# EAGLE design VoltageLevelMeter3 (EAGLE 9.6.2)
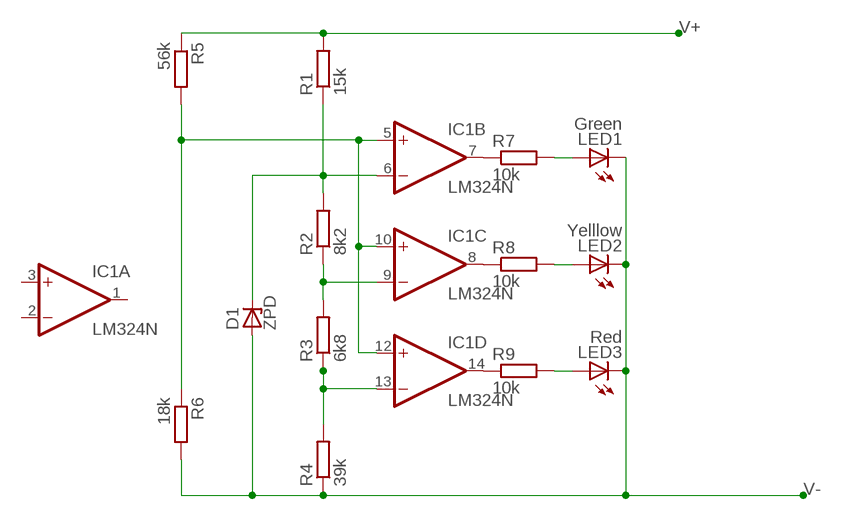
[diagram p0: schematic, sheet 1]

## Parts
D1  ZPD  [DO35Z10]
IC1  LM324N  [DIL14]
LED1  Green  LED3MM  [LED3MM]
LED2  Yelllow  LED3MM  [LED3MM]
LED3  Red  LED3MM  [LED3MM]
R1  15k  R-EU_0207/7  [0207/7]
R2  8k2  R-EU_0207/7  [0207/7]
R3  6k8  R-EU_0207/7  [0207/7]
R4  39k  R-EU_0207/7  [0207/7]
R5  56k  R-EU_0207/7  [0207/7]
R6  18k  R-EU_0207/7  [0207/7]
R7  10k  R-EU_0207/7  [0207/7]
R8  10k  R-EU_0207/7  [0207/7]
R9  10k  R-EU_0207/7  [0207/7]

## Nets
N$1: D1.C IC1.6(B:-IN) R1.1 R2.2
N$2: IC1.9(C:-IN) R2.1 R3.2
N$3: IC1.13(D:-IN) R3.1 R4.2
N$4: IC1.14(D:OUT) R9.1
N$5: IC1.8(C:OUT) R8.1
N$6: IC1.7(B:OUT) R7.1
N$7: IC1.5(B:+IN) IC1.10(C:+IN) IC1.12(D:+IN) R5.2 R6.1
N$10: LED1.A R7.2
N$11: LED2.A R8.2
N$12: LED3.A R9.2
V+: R1.2 R5.1
V-: D1.A LED1.K(C) LED2.K(C) LED3.K(C) R4.1 R6.2
Unconnected: IC1.1(A:OUT) IC1.2(A:-IN) IC1.3(A:+IN)

## Power pins joined to a net without a drawn wire
V+: IC1.4(P:V+)
V-: IC1.11(P:V-)

## Library data of the parts
D1 = diode:ZPD: Z DIODE 500 mW
IC1 = linear:LM324: OP AMP
LED1-LED3 = led:LED: LED OSRAM: - CHIPLED LG R971, LG N971, LY N971, LG Q971, LY Q971, LO R971, LY R971 LH N974, LH R974 LS Q976, LO Q976, LY Q976 LO Q996 - Hyper CHIPLED LW Q18S LB Q993, LB Q99A, LB R99A - SideLED LS A670, LO A670, LY A670, LG A670, LP A670 LB A673, LV A673, LT A673, LW A673 LH A674 LY A675 LS A676, LA A676, LO A676, LY A676, LW A676 LS A679, LY A679, LG A679 - Hyper Micro SIDELED® LS Y876, LA Y876, LO Y876, LY Y876 LT Y87S - SmartLED LW L88C, LW L88S LB L89C, LB L89S, LG L890 LS L89K, LO L89K, LY L89K LS L896, LA L896, LO L896, LY L896 - TOPLED LS T670, LO T670, LY T670, LG T670, LP T670 LSG T670, LSP T670, LSY T670, LOP T670, LYG T670 LG T671, LOG T671, LSG T671 LB T673, LV T673, LT T673, LW T673 LH T674 LS T676, LA T676, LO T676, LY T676, LB T676, LH T676, LSB T676, LW T676 LB T67C, LV T67C, LT T67C, LS T67K, LO T67K, LY T67K, LW E67C LS E67B, LA E67B, LO E67B, LY E67B, LB E67C, LV E67C, LT E67C LW T67C LS T679, LY T679, LG T679 LS T770, LO T770, LY T770, LG T770, LP T770 LB T773, LV T773, LT T773, LW T773 LH T774 LS E675, LA E675, LY E675, LS T675 LS T776, LA T776, LO T776, LY T776, LB T776 LHGB T686 LT T68C, LB T68C - Hyper Mini TOPLED® LB M676 - Mini TOPLED Santana® LG M470 LS M47K, LO M47K, LY M47K Source: http://www.osram.convergy.de LUXEON: - LUMILED® LXK2-PW12-R00, LXK2-PW12-S00, LXK2-PW14-U00, LXK2-PW14-V00 LXK2-PM12-R00, LXK2-PM12-S00, LXK2-PM14-U00 LXK2-PE12-Q00, LXK2-PE12-R00, LXK2-PE12-S00, LXK2-PE14-T00, LXK2-PE14-U00 LXK2-PB12-K00, LXK2-PB12-L00, LXK2-PB12-M00, LXK2-PB14-N00, LXK2-PB14-P00, LXK2-PB14-Q00 LXK2-PR12-L00, LXK2-PR12-M00, LXK2-PR14-Q00, LXK2-PR14-R00 LXK2-PD12-Q00, LXK2-PD12-R00, LXK2-PD12-S00 LXK2-PH12-R00, LXK2-PH12-S00 LXK2-PL12-P00, LXK2-PL12-Q00, LXK2-PL12-R00 Source: www.luxeon.com KINGBRIGHT: KA-3528ASYC Source: www.kingbright.com
R1-R9 = resistor:R-EU_: RESISTOR, European symbol

## Net classes
0 default: clearance 0.355 mm

## Board
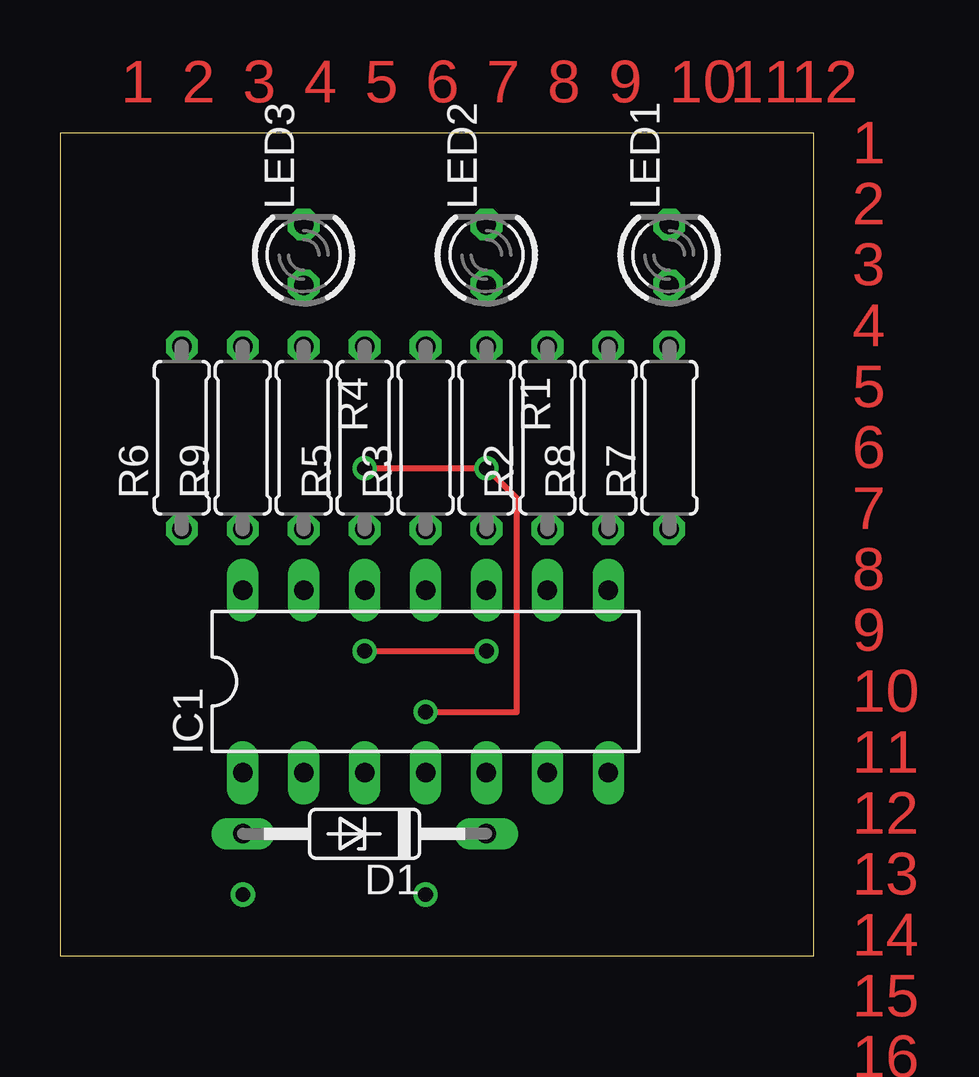
[diagram p1: board, top side]
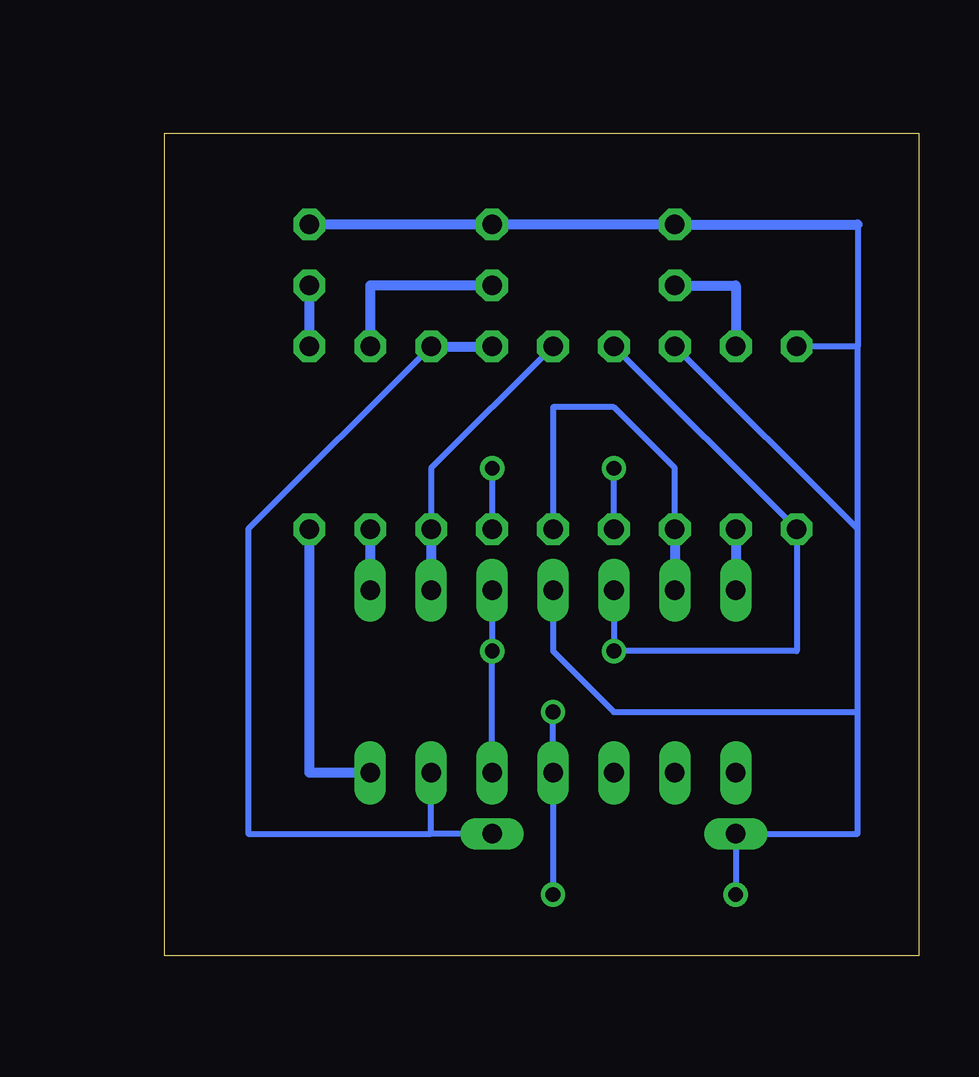
[diagram p2: board, bottom side, seen from below]

Size 31.42 x 34.28 mm. Coordinates in mm from the lower left corner, seen from the top.
Outline: 0,0 31.42,0 31.42,34.28 0,34.28 0,0
Copper layers (1*16): Top 0.035mm / dielectric 1.5mm / Bottom 0.035mm
Design rules "default": minimum track width 10mil, minimum drill 24mil, track to track 8mil, track to pad 8mil, pad to pad 8mil, via to via 8mil, smd to smd 8mil, copper to edge 40mil, drill to drill 8mil, minimum pad ring 10mil, minimum via ring 8mil, stop-mask expansion 4mil, vias tented up to drill 0mil, thermal gap 10mil

### Footprints (pad centres in the part's own frame; a part is rotated, then mirrored left to right if it is on the bottom)
DO35Z10 = drill 0.813 long: A 5.08,0; C -5.08,0
DIL14 = drill 0.813 long: 1 -7.62,-3.81; 2 -5.08,-3.81; 3 -2.54,-3.81; 4 0,-3.81; 5 2.54,-3.81; 6 5.08,-3.81; 7 7.62,-3.81; 8 7.62,3.81; 9 5.08,3.81; 10 2.54,3.81; 11 0,3.81; 12 -2.54,3.81; 13 -5.08,3.81; 14 -7.62,3.81
LED3MM = drill 0.813 octagon: A -1.27,0; K 1.27,0
0207/7 = drill 0.813 octagon: 1 -3.81,0; 2 3.81,0

### Placement (x,y rotation side)
D1  12.7,5.08 180 top
IC1  15.24,11.43 0 top
LED1  25.4,29.21 90 top
LED2  17.78,29.21 90 top
LED3  10.16,29.21 90 top
R1  17.78,21.59 270 top
R2  20.32,21.59 90 top
R3  15.24,21.59 90 top
R4  10.16,21.59 270 top
R5  12.7,21.59 90 top
R6  5.08,21.59 90 top
R7  25.4,21.59 90 top
R8  22.86,21.59 90 top
R9  7.62,21.59 90 top

### Tracks (layer width: path | path; a pad name or v marks a point on that pad's centre or on a via)
N$1
  Bottom 0.254: R2.2 27.94,17.78 27.94,5.08 20.32,5.08 | 20.32,5.08 IC1.6 | D1.C 20.32,5.08
  Bottom 0.406: R2.2 R1.1
N$2
  Bottom 0.254: R2.1 20.32,20.32 R3.2
  Bottom 0.406: R2.1 IC1.9
N$3
  Bottom 0.254: R4.2 10.16,20.32 12.7,22.86 15.24,22.86 R3.1
  Bottom 0.406: R4.2 IC1.13
N$4
  Bottom 0.406: R9.1 IC1.14
N$5
  Bottom 0.406: R8.1 IC1.8
N$6
  Bottom 0.406: R7.1 25.4,7.62 IC1.7
N$7  (via drill 0.61)
  Top 0.254: v12.7,12.7 v17.78,12.7
  Bottom 0.254: R5.2 R6.1 5.08,12.7 v12.7,12.7 IC1.12 | IC1.5 v17.78,12.7 IC1.10
N$10
  Bottom 0.406: LED1.A R7.2
N$11
  Bottom 0.406: LED2.A 22.86,27.94 R8.2
N$12
  Bottom 0.406: LED3.A 7.62,27.94 R9.2
V+  (via drill 0.61)
  Top 0.254: v12.7,20.32 v17.78,20.32 19.05,19.05 19.05,10.16 v15.24,10.16
  Bottom 0.254: R5.1 v12.7,20.32 | v17.78,20.32 R1.2 | v15.24,10.16 IC1.4 v15.24,2.54
V-  (via drill 0.61)
  Bottom 0.254: 2.54,17.78 2.54,25.4 | 2.54,25.4 R6.2 | 2.54,30.48 2.54,25.4 | IC1.11 15.24,12.7 12.7,10.16 2.54,10.16 | R4.1 2.54,17.78 | 2.54,10.16 2.54,5.08 D1.A v7.62,2.54 | 2.54,10.16 2.54,17.78
  Bottom 0.406: LED1.K LED2.K LED3.K 2.54,30.48

### Text on the board
Top: 1 | 2 | 3 | 4 | 5 | 6 | 7 | 8 | 9 | 10 | 11 | 12 | 1 | 2 | 3 | 4 | 5 | 6 | 7 | 8 | 9 | 10 | 11 | 12 | 13 | 14 | 15 | 16